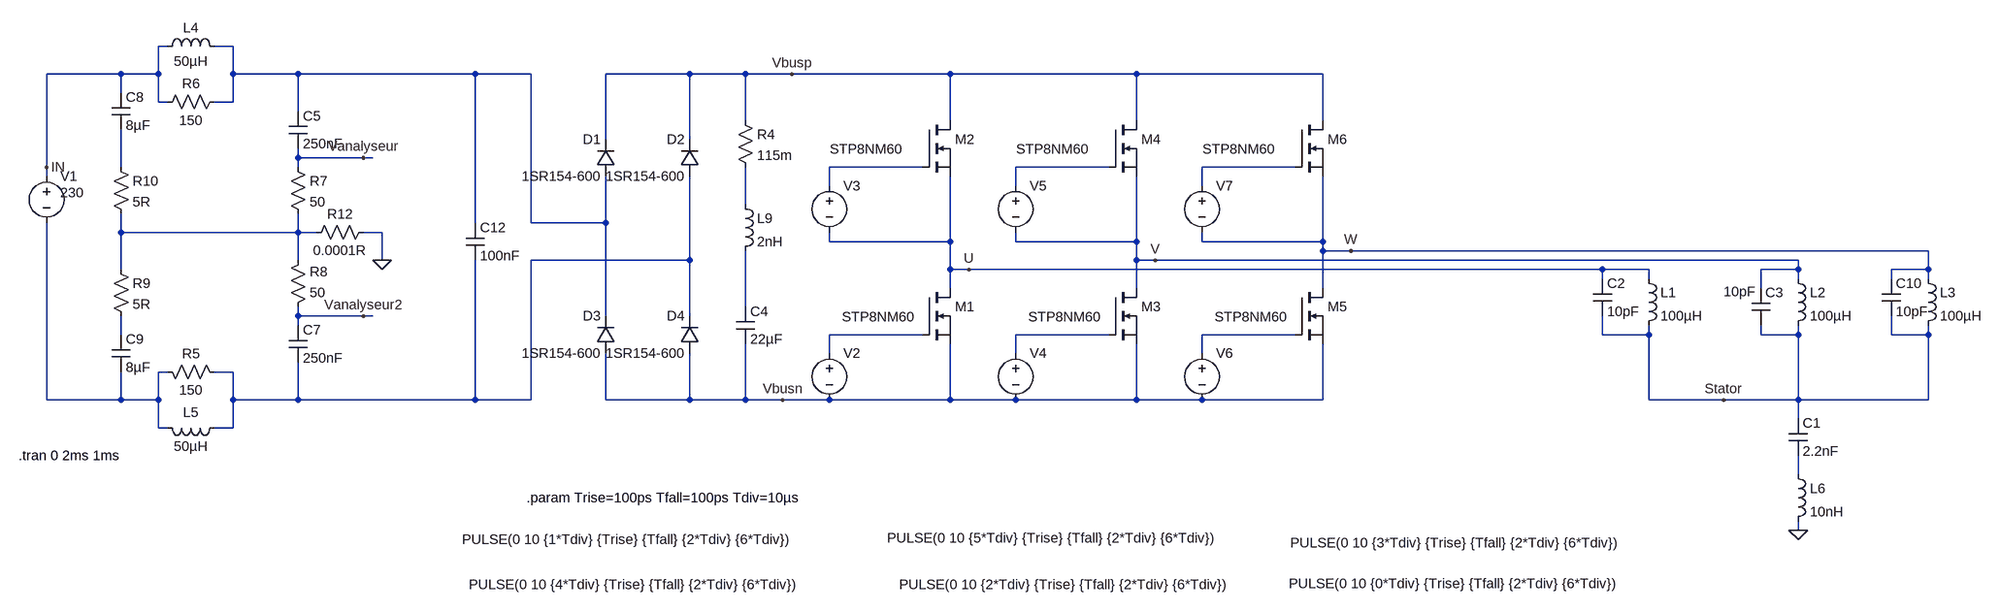
[diagram p0: schematic Part 6 - BLDC and Inverter.asc]
Part 6 - BLDC and Inverter.asc, the LTspice schematic file:
Version 4
SHEET 1 2580 884
WIRE -768 -64 -784 -64
WIRE -656 -64 -688 -64
WIRE -848 -16 -976 -16
WIRE -784 -16 -784 -64
WIRE -784 -16 -848 -16
WIRE -656 -16 -656 -64
WIRE -544 -16 -656 -16
WIRE -208 -16 -544 -16
WIRE -112 -16 -208 -16
WIRE 160 -16 16 -16
WIRE 256 -16 160 -16
WIRE 336 -16 256 -16
WIRE 608 -16 336 -16
WIRE 928 -16 608 -16
WIRE 1248 -16 928 -16
WIRE -848 16 -848 -16
WIRE -784 32 -784 -16
WIRE -768 32 -784 32
WIRE -656 32 -656 -16
WIRE -656 32 -688 32
WIRE -544 48 -544 -16
WIRE 256 64 256 -16
WIRE 608 64 608 -16
WIRE 928 64 928 -16
WIRE 1248 64 1248 -16
WIRE 16 96 16 -16
WIRE 160 96 160 -16
WIRE -544 128 -544 112
WIRE -432 128 -544 128
WIRE -416 128 -432 128
WIRE -976 144 -976 -16
WIRE -848 144 -848 80
WIRE -544 144 -544 128
WIRE 560 144 400 144
WIRE 880 144 720 144
WIRE 1200 144 1040 144
WIRE -976 160 -976 144
WIRE 400 176 400 144
WIRE 720 176 720 144
WIRE 1040 176 1040 144
WIRE 256 208 256 144
WIRE -208 240 -208 -16
WIRE -112 240 -112 -16
WIRE 16 240 16 160
WIRE 16 240 -112 240
WIRE -848 256 -848 224
WIRE -544 256 -544 224
WIRE -544 256 -848 256
WIRE -512 256 -544 256
WIRE -400 256 -432 256
WIRE 400 272 400 256
WIRE 608 272 608 160
WIRE 608 272 400 272
WIRE 720 272 720 256
WIRE 928 272 928 160
WIRE 928 272 720 272
WIRE 1040 272 1040 256
WIRE 1248 272 1248 160
WIRE 1248 272 1040 272
WIRE 1248 288 1248 272
WIRE 1296 288 1248 288
WIRE 2288 288 1296 288
WIRE -544 304 -544 256
WIRE -400 304 -400 256
WIRE 160 304 160 160
WIRE 160 304 -112 304
WIRE 928 304 928 272
WIRE 960 304 928 304
WIRE 2064 304 960 304
WIRE -848 320 -848 256
WIRE 608 320 608 272
WIRE 640 320 608 320
WIRE 1728 320 640 320
WIRE 1808 320 1728 320
WIRE 2064 320 2064 304
WIRE 2064 320 2000 320
WIRE 2288 320 2288 288
WIRE 2288 320 2224 320
WIRE 1728 336 1728 320
WIRE 1808 336 1808 320
WIRE 2064 336 2064 320
WIRE 2224 336 2224 320
WIRE 2288 336 2288 320
WIRE 608 352 608 320
WIRE 928 352 928 304
WIRE 1248 352 1248 288
WIRE 2000 352 2000 320
WIRE 256 384 256 288
WIRE -544 400 -544 384
WIRE -432 400 -544 400
WIRE -416 400 -432 400
WIRE 16 400 16 240
WIRE 160 400 160 304
WIRE -544 416 -544 400
WIRE -848 432 -848 400
WIRE 560 432 400 432
WIRE 880 432 720 432
WIRE 1200 432 1040 432
WIRE 1728 432 1728 400
WIRE 1808 432 1808 416
WIRE 1808 432 1728 432
WIRE 2000 432 2000 416
WIRE 2064 432 2064 416
WIRE 2064 432 2000 432
WIRE 2224 432 2224 400
WIRE 2288 432 2288 416
WIRE 2288 432 2224 432
WIRE 400 464 400 432
WIRE 720 464 720 432
WIRE 1040 464 1040 432
WIRE -768 496 -784 496
WIRE -656 496 -688 496
WIRE -976 544 -976 240
WIRE -848 544 -848 496
WIRE -848 544 -976 544
WIRE -784 544 -784 496
WIRE -784 544 -848 544
WIRE -656 544 -656 496
WIRE -544 544 -544 480
WIRE -544 544 -656 544
WIRE -208 544 -208 304
WIRE -208 544 -544 544
WIRE -112 544 -112 304
WIRE -112 544 -208 544
WIRE 16 544 16 464
WIRE 160 544 160 464
WIRE 160 544 16 544
WIRE 256 544 256 448
WIRE 256 544 160 544
WIRE 320 544 256 544
WIRE 400 544 320 544
WIRE 608 544 608 448
WIRE 608 544 400 544
WIRE 720 544 608 544
WIRE 928 544 928 448
WIRE 928 544 720 544
WIRE 1040 544 928 544
WIRE 1248 544 1248 448
WIRE 1248 544 1040 544
WIRE 1808 544 1808 432
WIRE 1936 544 1808 544
WIRE 2064 544 2064 432
WIRE 2064 544 1936 544
WIRE 2288 544 2288 432
WIRE 2288 544 2064 544
WIRE 2064 576 2064 544
WIRE -784 592 -784 544
WIRE -768 592 -784 592
WIRE -656 592 -656 544
WIRE -656 592 -688 592
WIRE 2064 672 2064 640
WIRE 2064 768 2064 752
FLAG -976 144 IN
FLAG -432 128 Vanalyseur
FLAG -432 400 Vanalyseur2
FLAG -400 304 0
FLAG 2064 768 0
FLAG 1936 544 Stator
FLAG 640 320 U
FLAG 960 304 V
FLAG 1296 288 W
FLAG 336 -16 Vbusp
FLAG 320 544 Vbusn
SYMBOL voltage -976 144 R0
WINDOW 123 0 0 Left 2
WINDOW 39 0 0 Left 2
WINDOW 3 24 44 Left 2
SYMATTR Value 230
SYMATTR InstName V1
SYMBOL ind -784 -48 R270
WINDOW 0 32 56 VTop 2
WINDOW 3 5 56 VBottom 2
SYMATTR InstName L4
SYMATTR Value 50µH
SYMBOL res -672 16 R90
WINDOW 0 0 56 VBottom 2
WINDOW 3 32 56 VTop 2
SYMATTR InstName R6
SYMATTR Value 150
SYMBOL cap -560 48 R0
SYMATTR InstName C5
SYMATTR Value 250nF
SYMBOL res -560 128 R0
SYMATTR InstName R7
SYMATTR Value 50
SYMBOL ind -784 576 M90
WINDOW 0 5 56 VBottom 2
WINDOW 3 32 56 VTop 2
SYMATTR InstName L5
SYMATTR Value 50µH
SYMBOL res -672 512 M270
WINDOW 0 32 56 VTop 2
WINDOW 3 0 56 VBottom 2
SYMATTR InstName R5
SYMATTR Value 150
SYMBOL cap -560 480 M180
WINDOW 0 24 56 Left 2
WINDOW 3 24 8 Left 2
SYMATTR InstName C7
SYMATTR Value 250nF
SYMBOL res -560 400 M180
WINDOW 0 36 76 Left 2
WINDOW 3 36 40 Left 2
SYMATTR InstName R8
SYMATTR Value 50
SYMBOL cap -864 16 R0
SYMATTR InstName C8
SYMATTR Value 8µF
SYMBOL cap -864 432 R0
SYMATTR InstName C9
SYMATTR Value 8µF
SYMBOL res -864 304 R0
SYMATTR InstName R9
SYMATTR Value 5R
SYMBOL res -864 128 R0
SYMATTR InstName R10
SYMATTR Value 5R
SYMBOL nmos 560 352 R0
WINDOW 3 -138 49 Left 2
SYMATTR Value STP8NM60
SYMATTR InstName M1
SYMBOL diode 32 160 R180
WINDOW 0 24 64 Left 2
WINDOW 3 24 0 Left 2
SYMATTR InstName D1
SYMATTR Value 1SR154-600
SYMBOL voltage 400 448 R0
WINDOW 123 0 0 Left 0
WINDOW 39 0 0 Left 0
WINDOW 3 -619 413 Left 2
SYMATTR Value PULSE(0 10 {4*Tdiv} {Trise} {Tfall} {2*Tdiv} {6*Tdiv})
SYMATTR InstName V2
SYMBOL diode 176 160 R180
WINDOW 0 24 64 Left 2
WINDOW 3 24 0 Left 2
SYMATTR InstName D2
SYMATTR Value 1SR154-600
SYMBOL diode 32 464 R180
WINDOW 0 24 64 Left 2
WINDOW 3 24 0 Left 2
SYMATTR InstName D3
SYMATTR Value 1SR154-600
SYMBOL diode 176 464 R180
WINDOW 0 24 64 Left 2
WINDOW 3 24 0 Left 2
SYMATTR InstName D4
SYMATTR Value 1SR154-600
SYMBOL cap 240 384 R0
SYMATTR InstName C4
SYMATTR Value 22µF
SYMATTR SpiceLine Ic=229V
SYMBOL res 240 48 R0
SYMATTR InstName R4
SYMATTR Value 115m
SYMBOL ind 240 192 R0
SYMATTR InstName L9
SYMATTR Value 2nH
SYMBOL cap -224 240 R0
SYMATTR InstName C12
SYMATTR Value 100nF
SYMATTR SpiceLine Lser=1nH
SYMBOL res -416 240 R90
WINDOW 0 0 56 VBottom 2
WINDOW 3 32 56 VTop 2
SYMATTR InstName R12
SYMATTR Value 0.0001R
SYMBOL ind 1792 320 R0
SYMATTR InstName L1
SYMATTR Value 100µH
SYMATTR SpiceLine Rser=1.6 Rpar=1500
SYMBOL ind 2048 320 R0
SYMATTR InstName L2
SYMATTR Value 100µH
SYMATTR SpiceLine Rser=1.6 Rpar=1500
SYMBOL ind 2272 320 R0
SYMATTR InstName L3
SYMATTR Value 100µH
SYMATTR SpiceLine Rser=1.6 Rpar=1500
SYMBOL nmos 560 64 R0
WINDOW 3 -159 49 Left 2
SYMATTR Value STP8NM60
SYMATTR InstName M2
SYMBOL voltage 400 160 R0
WINDOW 123 0 0 Left 0
WINDOW 39 0 0 Left 0
WINDOW 3 -631 624 Left 2
SYMATTR Value PULSE(0 10 {1*Tdiv} {Trise} {Tfall} {2*Tdiv} {6*Tdiv})
SYMATTR InstName V3
SYMBOL nmos 880 352 R0
WINDOW 3 -138 49 Left 2
SYMATTR Value STP8NM60
SYMATTR InstName M3
SYMBOL voltage 720 448 R0
WINDOW 123 0 0 Left 0
WINDOW 39 0 0 Left 0
WINDOW 3 -200 413 Left 2
SYMATTR Value PULSE(0 10 {2*Tdiv} {Trise} {Tfall} {2*Tdiv} {6*Tdiv})
SYMATTR InstName V4
SYMBOL nmos 880 64 R0
WINDOW 3 -159 49 Left 2
SYMATTR Value STP8NM60
SYMATTR InstName M4
SYMBOL voltage 720 160 R0
WINDOW 123 0 0 Left 0
WINDOW 39 0 0 Left 0
WINDOW 3 -221 621 Left 2
SYMATTR Value PULSE(0 10 {5*Tdiv} {Trise} {Tfall} {2*Tdiv} {6*Tdiv})
SYMATTR InstName V5
SYMBOL nmos 1200 352 R0
WINDOW 3 -138 49 Left 2
SYMATTR Value STP8NM60
SYMATTR InstName M5
SYMBOL voltage 1040 448 R0
WINDOW 123 0 0 Left 0
WINDOW 39 0 0 Left 0
WINDOW 3 149 412 Left 2
SYMATTR Value PULSE(0 10 {0*Tdiv} {Trise} {Tfall} {2*Tdiv} {6*Tdiv})
SYMATTR InstName V6
SYMBOL nmos 1200 64 R0
WINDOW 3 -159 49 Left 2
SYMATTR Value STP8NM60
SYMATTR InstName M6
SYMBOL voltage 1040 160 R0
WINDOW 123 0 0 Left 0
WINDOW 39 0 0 Left 0
WINDOW 3 152 630 Left 2
SYMATTR Value PULSE(0 10 {3*Tdiv} {Trise} {Tfall} {2*Tdiv} {6*Tdiv})
SYMATTR InstName V7
SYMBOL cap 1712 336 R0
SYMATTR InstName C2
SYMATTR Value 10pF
SYMBOL cap 1984 352 R0
WINDOW 3 -48 6 Left 2
SYMATTR Value 10pF
SYMATTR InstName C3
SYMBOL ind 2048 656 R0
SYMATTR InstName L6
SYMATTR Value 10nH
SYMATTR SpiceLine Rser=1 Rpar=150
SYMBOL cap 2208 336 R0
SYMATTR InstName C10
SYMATTR Value 10pF
SYMBOL cap 2048 576 R0
SYMATTR InstName C1
SYMATTR Value 2.2nF
TEXT -1024 640 Left 2 !.tran 0 2ms 1ms
TEXT -120 712 Left 2 !.param Trise=100ps Tfall=100ps Tdiv=10µs

The netlist it stands for:
* Part 6 - BLDC and Inverter.asc
V1 IN N014 230
L4 IN N001 50µH
R6 N001 IN 150
C5 N001 Vanalyseur 250nF
R7 Vanalyseur N007 50
L5 N014 N008 50µH
R5 N008 N014 150
C7 N008 Vanalyseur2 250nF
R8 Vanalyseur2 N007 50
C8 IN N002 8µF
C9 N010 N014 8µF
R9 N007 N010 5R
R10 N002 N007 5R
M1 U N011 Vbusn Vbusn STP8NM60
D1 N001 Vbusp 1SR154-600
V2 N011 Vbusn PULSE(0 10 {4*Tdiv} {Trise} {Tfall} {2*Tdiv} {6*Tdiv})
D2 N008 Vbusp 1SR154-600
D3 Vbusn N001 1SR154-600
D4 Vbusn N008 1SR154-600
C4 N009 Vbusn 22µF Ic=229V
R4 Vbusp N006 115m
L9 N006 N009 2nH
C12 N001 N008 100nF Lser=1nH
R12 0 N007 0.0001R
L1 U Stator 100µH Rser=1.6 Rpar=1500
L2 V Stator 100µH Rser=1.6 Rpar=1500
L3 W Stator 100µH Rser=1.6 Rpar=1500
M2 Vbusp N003 U U STP8NM60
V3 N003 U PULSE(0 10 {1*Tdiv} {Trise} {Tfall} {2*Tdiv} {6*Tdiv})
M3 V N012 Vbusn Vbusn STP8NM60
V4 N012 Vbusn PULSE(0 10 {2*Tdiv} {Trise} {Tfall} {2*Tdiv} {6*Tdiv})
M4 Vbusp N004 V V STP8NM60
V5 N004 V PULSE(0 10 {5*Tdiv} {Trise} {Tfall} {2*Tdiv} {6*Tdiv})
M5 W N013 Vbusn Vbusn STP8NM60
V6 N013 Vbusn PULSE(0 10 {0*Tdiv} {Trise} {Tfall} {2*Tdiv} {6*Tdiv})
M6 Vbusp N005 W W STP8NM60
V7 N005 W PULSE(0 10 {3*Tdiv} {Trise} {Tfall} {2*Tdiv} {6*Tdiv})
C2 U Stator 10pF
C3 V Stator 10pF
L6 N015 0 10nH Rser=1 Rpar=150
C10 W Stator 10pF
C1 Stator N015 2.2nF
.model D D
.lib standard.dio
.model NMOS NMOS
.model PMOS PMOS
.lib standard.mos
.tran 0 2ms 1ms
.param Trise=100ps Tfall=100ps Tdiv=10µs
.backanno
.end